# EAGLE design ECU (EAGLE 6.6.0)

## Sheet 1 of 3
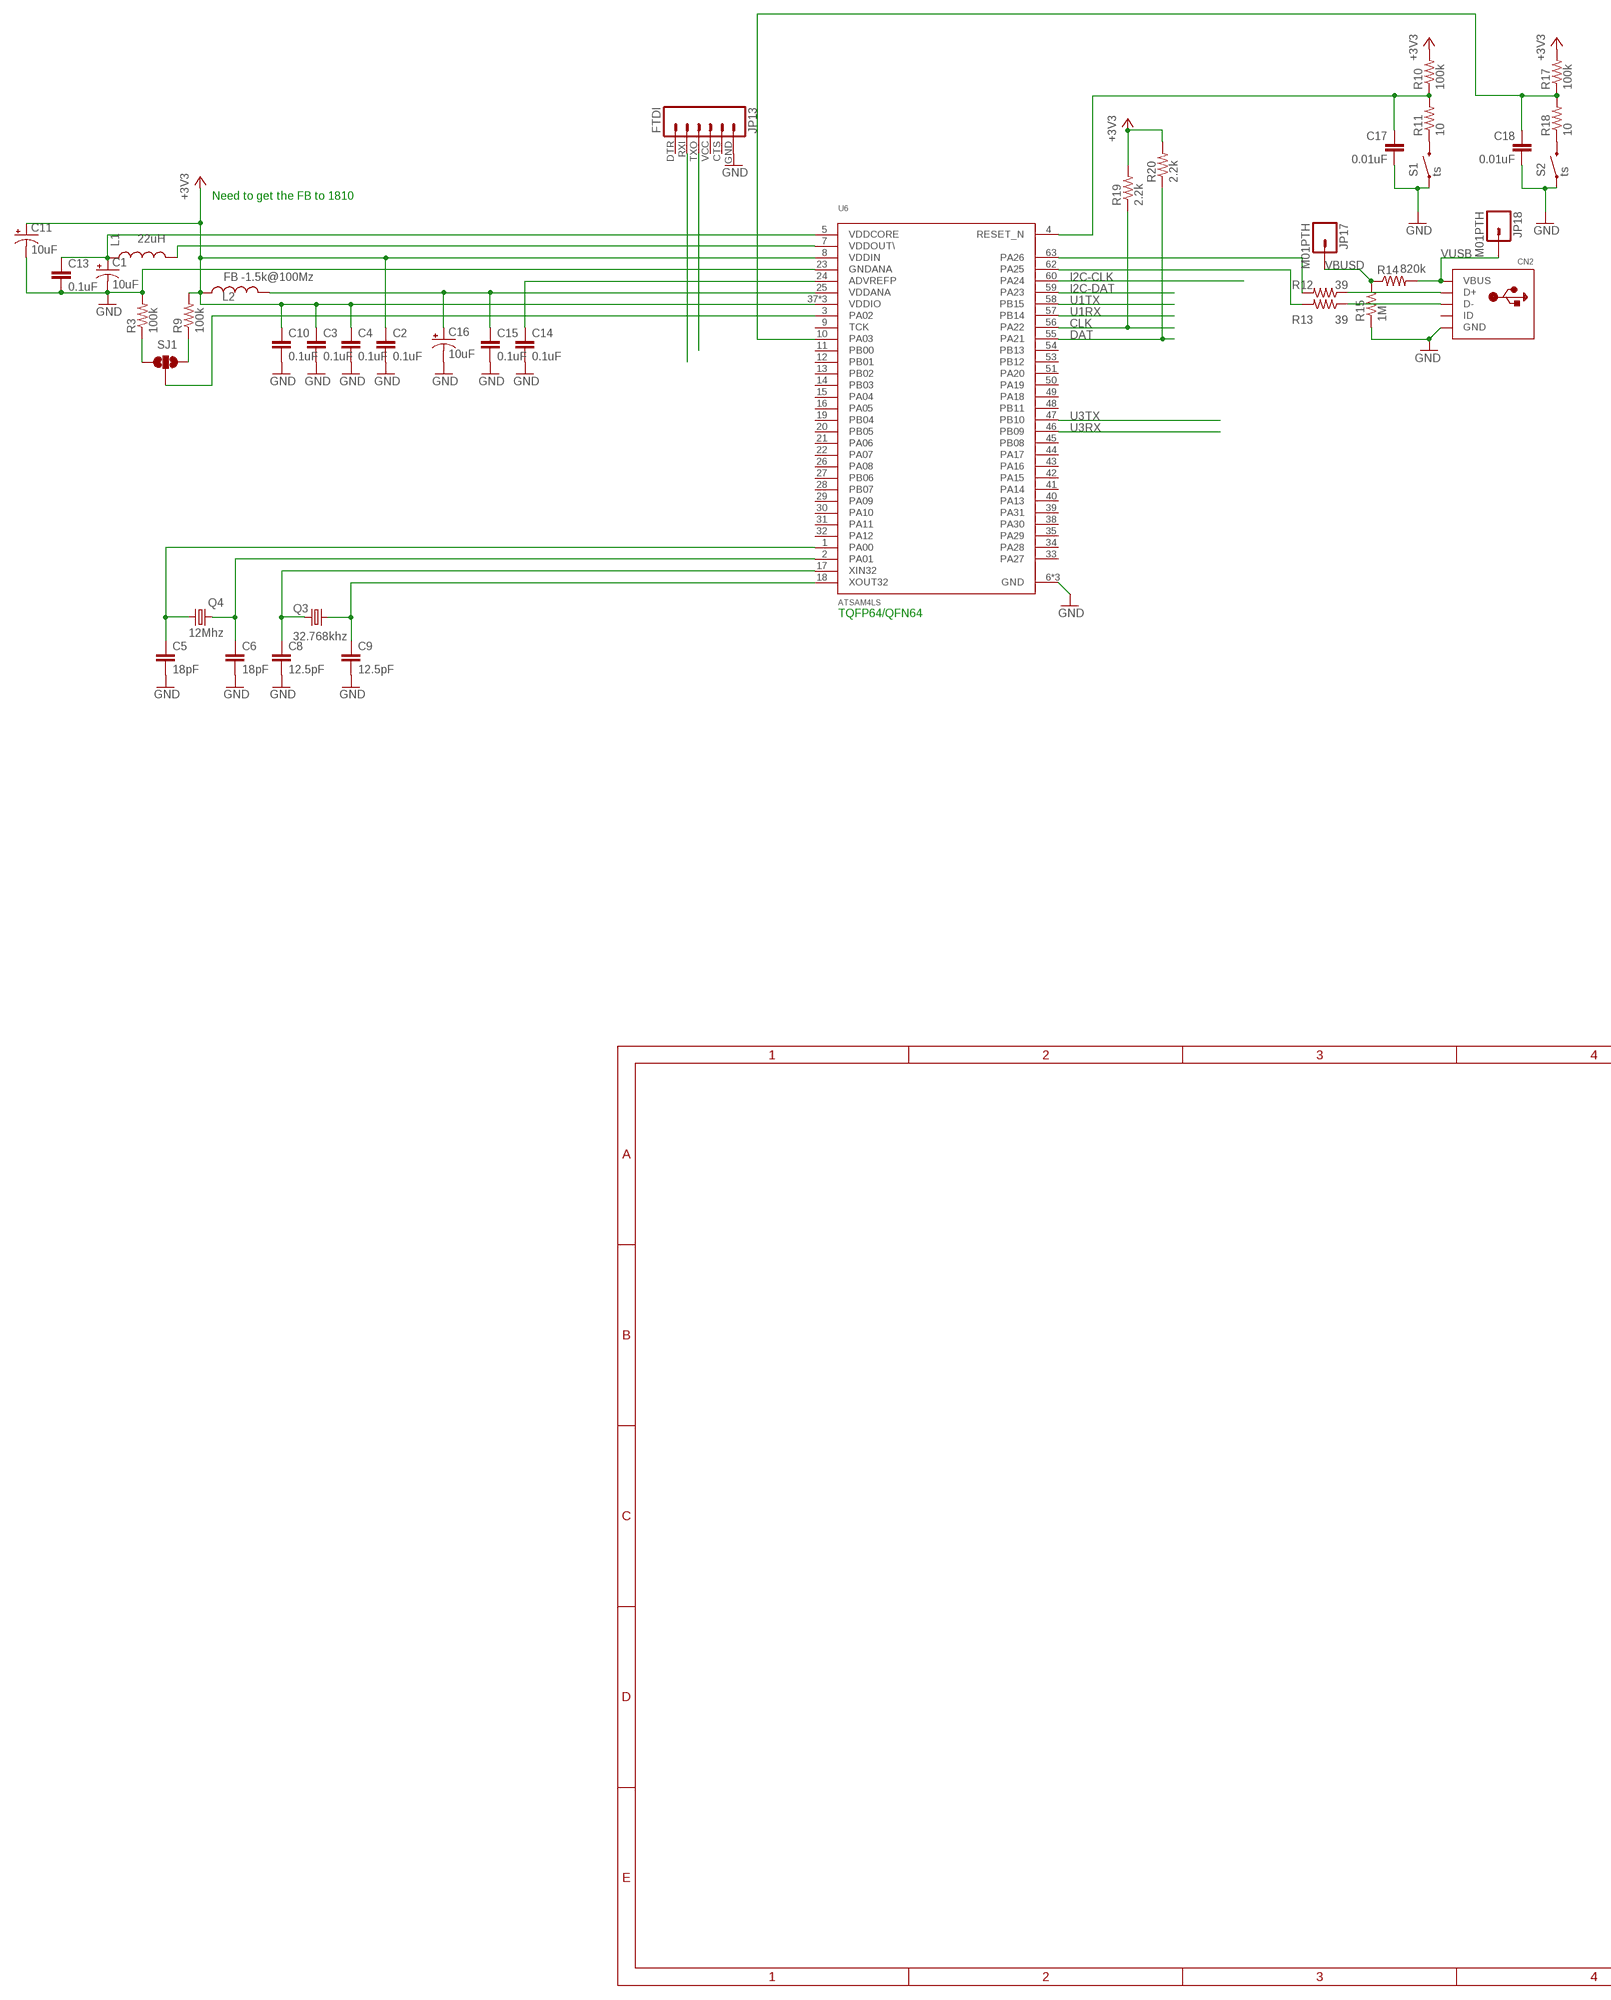
[diagram p0: schematic, sheet 1, part 1 of 2]
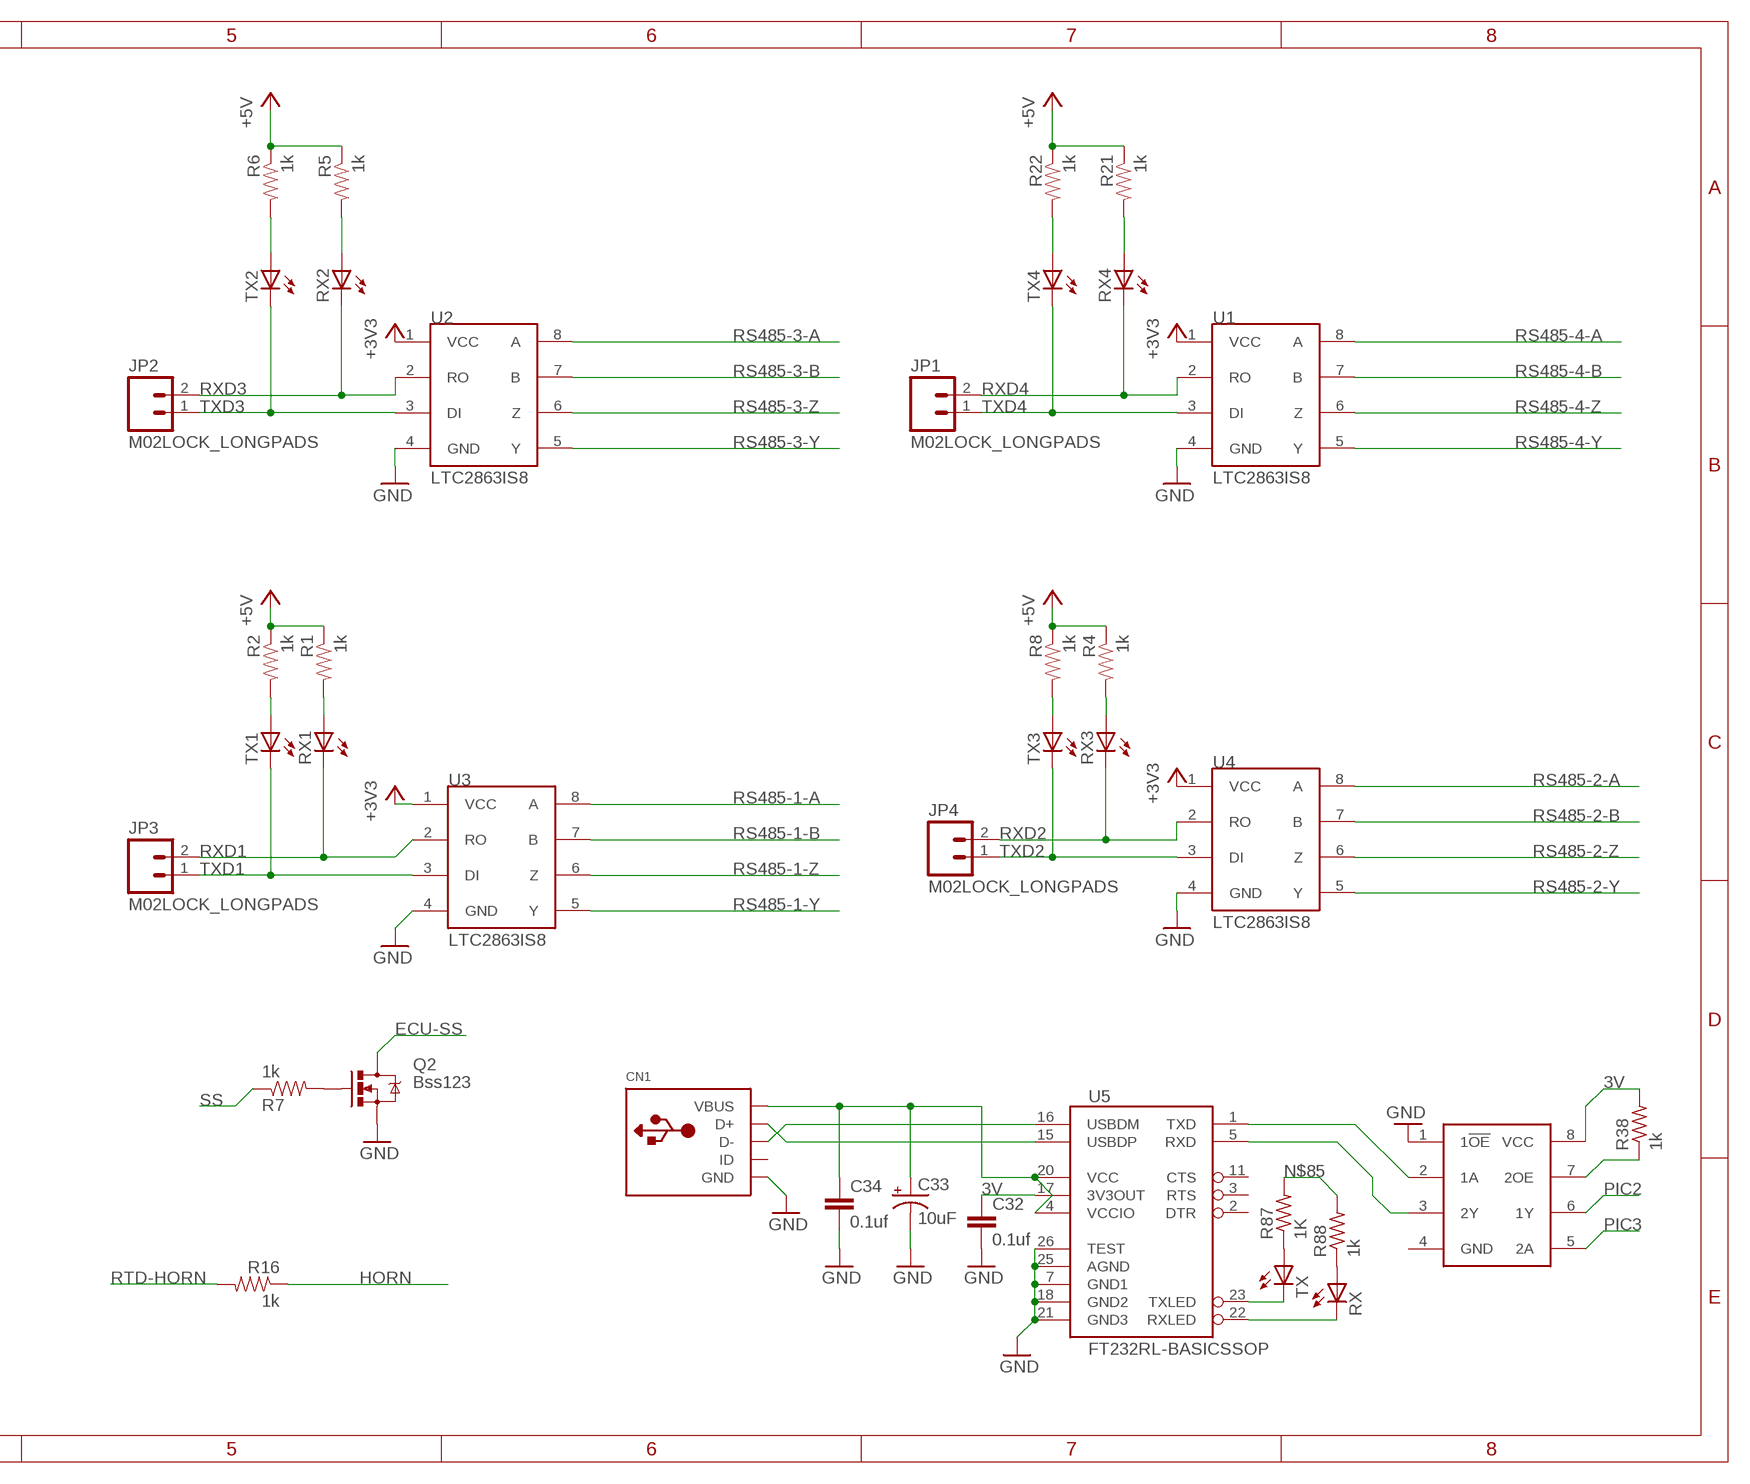
[diagram p1: schematic, sheet 1, part 2 of 2]

### Parts
C1  10uF  CAP_POL1206  [EIA3216]
C2  0.1uF  CAP0805  [0805]
C3  0.1uF  CAP0805  [0805]
C4  0.1uF  CAP0805  [0805]
C5  18pF  CAP0805  [0805]
C6  18pF  CAP0805  [0805]
C8  12.5pF  CAP0805  [0805]
C9  12.5pF  CAP0805  [0805]
C10  0.1uF  CAP0805  [0805]
C11  10uF  10UF-16V-10%(TANT)  [EIA3216]
C13  0.1uF  CAP0805  [0805]
C14  0.1uF  CAP0805  [0805]
C15  0.1uF  CAP0805  [0805]
C16  10uF  CAP_POL1206  [EIA3216]
C17  0.01uF  CAP0805  [0805]
C18  0.01uF  CAP0805  [0805]
C32  0.1uf  CAP0805  [0805]
C33  10uF  CAP_POL1206  [EIA3216]
C34  0.1uf  CAP0805  [0805]
CN1  USBMOLEX  [USB-MINIB-THM-MOLEX]
CN2  USBMOLEX  [USB-MINIB-THM-MOLEX]
JP1  M02LOCK_LONGPADS  [1X02_LOCK_LONGPADS]
JP2  M02LOCK_LONGPADS  [1X02_LOCK_LONGPADS]
JP3  M02LOCK_LONGPADS  [1X02_LOCK_LONGPADS]
JP4  M02LOCK_LONGPADS  [1X02_LOCK_LONGPADS]
JP13  FTDI  FTDI_BASICPTH  [FTDI_BASIC]
JP17  M01PTH  [1X01]
JP18  M01PTH  [1X01]
L1  22uH  INDUCTOR0805  [0805]
L2  FB -1.5k@100Mz  INDUCTOR0805  [0805]
Q2  Bss123  MOSFET-NCHANNELBSS123LT1G  [SOT23]
Q3  32.768khz  CRYSTALMM20SS  [MM20SS]
Q4  12Mhz  CRYSTALCTS406  [CTS406]
R1  1k  RESISTOR0805-RES  [0805]
R2  1k  RESISTOR0805-RES  [0805]
R3  100k  RESISTOR0805-RES  [0805]
R4  1k  RESISTOR0805-RES  [0805]
R5  1k  RESISTOR0805-RES  [0805]
R6  1k  RESISTOR0805-RES  [0805]
R7  1k  RESISTOR0805-RES  [0805]
R8  1k  RESISTOR0805-RES  [0805]
R9  100k  RESISTOR0805-RES  [0805]
R10  100k  RESISTOR0805-RES  [0805]
R11  10  RESISTOR0805-RES  [0805]
R12  39  RESISTOR0805-RES  [0805]
R13  39  RESISTOR0805-RES  [0805]
R14  820k  RESISTOR0805-RES  [0805]
R15  1M  RESISTOR0805-RES  [0805]
R16  1k  RESISTOR0805-RES  [0805]
R17  100k  RESISTOR0805-RES  [0805]
R18  10  RESISTOR0805-RES  [0805]
R19  2.2k  RESISTOR0805-RES  [0805]
R20  2.2k  RESISTOR0805-RES  [0805]
R21  1k  RESISTOR0805-RES  [0805]
R22  1k  RESISTOR0805-RES  [0805]
R38  1k  R-US_R0805  [R0805]
R87  1K  R-US_R0805  [R0805]
R88  1k  R-US_R0805  [R0805]
RX  LEDCHIPLED_0805  [CHIPLED_0805]
RX1  LEDCHIP-LED0805  [CHIP-LED0805]
RX2  LEDCHIP-LED0805  [CHIP-LED0805]
RX3  LEDCHIP-LED0805  [CHIP-LED0805]
RX4  LEDCHIP-LED0805  [CHIP-LED0805]
S1  ts  SWITCH-MOMENTARY-2SIDE_EZ  [TACTILE-PTH-SIDEEZ]
S2  ts  SWITCH-MOMENTARY-2SIDE_EZ  [TACTILE-PTH-SIDEEZ]
SJ1  SOLDERJUMPER_2WAYS  [SJ_3]
TX  LEDCHIPLED_0805  [CHIPLED_0805]
TX1  LEDCHIP-LED0805  [CHIP-LED0805]
TX2  LEDCHIP-LED0805  [CHIP-LED0805]
TX3  LEDCHIP-LED0805  [CHIP-LED0805]
TX4  LEDCHIP-LED0805  [CHIP-LED0805]
U1  LTC2863IS8  ISL83077  [SO08]
U2  LTC2863IS8  ISL83077  [SO08]
U3  LTC2863IS8  ISL83077  [SO08]
U4  LTC2863IS8  ISL83077  [SO08]
U5  FT232RL-BASICSSOP  [SSOP28DB]
U6  ATSAM4LS  SAM4L  [TQFP-64]
U14  SN74LVC2G241DCTR  [VFSOP-8]

### Nets
3V: C32.1 R38.2 U5.17(3V3OUT) U14.8(VCC)
+3V3: C2.1 C3.1 C4.1 C10.1 C11.A(+) L2.1 R9.2 R10.2 R17.2 R19.2 R20.2 U1.1(VCC) U2.1(VCC) U3.1(VCC) U4.1(VCC) U6.8(VDDIN) U6.37(VDDIO) U6.52(VDDIO) U6.61(VDDIO) ; also sheet 2
+5V: R1.1 R2.1 R4.1 R5.1 R6.1 R8.1 R21.1 R22.1
CLK: R19.1 U6.56(PA22)
DAT: R20.1 U6.55(PA21)
ECU-SS: Q2.3(D)
GND: C1.C(-) C2.2 C3.2 C4.2 C5.2 C6.2 C8.2 C9.2 C10.2 C11.C(-) C13.2 C14.2 C15.2 C16.C(-) C17.2 C18.2 C32.2 C33.C(-) C34.2 CN1.GND CN2.GND JP13.GND Q2.2(S) R3.2 R15.1 S1.1 S2.1 U1.4(GND) U2.4(GND) U3.4(GND) U4.4(GND) U5.7(GND1) U5.18(GND2) U5.21(GND3) U5.25(AGND) U5.26(TEST) U6.6(GND) U6.23(GNDANA) U6.36(GND) U6.64(GND) U14.1(1!OE) ; also sheet 2,3
HORN: R16.1
I2C-CLK: U6.60(PA24)
I2C-DAT: U6.59(PA23)
N$2: R11.1 S1.2
N$3: L1.2 U6.7(VDDOUT\)
N$4: R38.1 U14.7(2OE)
N$5: C1.A(+) C13.1 L1.1 U6.5(VDDCORE)
N$6: C8.1 Q3.1 U6.17(XIN32)
N$7: R1.2 RX1.A
N$8: R2.2 TX1.A
N$9: C9.1 Q3.4 U6.18(XOUT32)
N$10: C6.1 Q4.1 U6.2(PA01)
N$11: C5.1 Q4.3 U6.1(PA00)
N$12: R4.2 RX3.A
N$13: R8.2 TX3.A
N$14: R3.1 SJ1.3
N$15: R9.1 SJ1.1
N$16: C15.1 C16.A(+) L2.2 U6.25(VDDANA)
N$17: R5.2 RX2.A
N$18: R6.2 TX2.A
N$19: SJ1.2 U6.3(PA02)
N$20: C14.1 U6.24(ADVREFP)
N$21: C17.1 R10.1 R11.2 U6.4(RESET_N)
N$22: CN2.D+ R12.1
N$24: R21.2 RX4.A
N$25: CN2.D- R13.1
N$26: R18.1 S2.2
N$27: C18.1 R17.1 R18.2 U6.10(PA03)
N$28: Q2.1(G) R7.2
N$29: R12.2 U6.63(PA26)
N$30: R13.2 U6.62(PA25)
N$44: R22.2 TX4.A
N$78: CN1.D- U5.16(USBDM)
N$79: CN1.D+ U5.15(USBDP)
N$81: R87.1 TX.A
N$82: R88.1 RX.A
N$83: TX.C U5.23(TXLED)
N$84: RX.C U5.22(RXLED)
N$85: C33.A(+) C34.1 CN1.VBUS R87.2 R88.2 U5.4(VCCIO) U5.20(VCC)
N$93: U5.1(TXD) U14.2(1A)
N$94: U5.5(RXD) U14.3(2Y)
PIC2: U14.6(1Y)
PIC3: U14.5(2A)
RS485-1-A: U3.8(A) ; also sheet 3
RS485-1-B: U3.7(B) ; also sheet 3
RS485-1-Y: U3.5(Y) ; also sheet 3
RS485-1-Z: U3.6(Z) ; also sheet 3
RS485-2-A: U4.8(A) ; also sheet 3
RS485-2-B: U4.7(B) ; also sheet 3
RS485-2-Y: U4.5(Y) ; also sheet 3
RS485-2-Z: U4.6(Z) ; also sheet 3
RS485-3-A: U2.8(A) ; also sheet 3
RS485-3-B: U2.7(B) ; also sheet 3
RS485-3-Y: U2.5(Y) ; also sheet 3
RS485-3-Z: U2.6(Z) ; also sheet 3
RS485-4-A: U1.8(A) ; also sheet 3
RS485-4-B: U1.7(B) ; also sheet 3
RS485-4-Y: U1.5(Y) ; also sheet 3
RS485-4-Z: U1.6(Z) ; also sheet 3
RTD-HORN: R16.2
RXD1: JP3.2 RX1.C U3.2(RO)
RXD2: JP4.2 RX3.C U4.2(RO)
RXD3: JP2.2 RX2.C U2.2(RO)
RXD4: JP1.2 RX4.C U1.2(RO)
SS: R7.1
TXD1: JP3.1 TX1.C U3.3(DI)
TXD2: JP4.1 TX3.C U4.3(DI)
TXD3: JP2.1 TX2.C U2.3(DI)
TXD4: JP1.1 TX4.C U1.3(DI)
U0RX: JP13.TXO
U0TX: JP13.RXI
U1RX: U6.57(PB14)
U1TX: U6.58(PB15)
U3RX: U6.46(PB09)
U3TX: U6.47(PB10)
VBUSD: JP17.1 R14.1 R15.2
VUSB: CN2.VBUS JP18.1 R14.2
Unconnected: CN1.ID CN2.ID JP13.CTS JP13.DTR JP13.VCC U5.2(DTR) U5.3(RTS) U5.11(CTS) U6.9(TCK) U6.11(PB00) U6.12(PB01) U6.13(PB02) U6.14(PB03) U6.15(PA04) U6.16(PA05) U6.19(PB04) U6.20(PB05) U6.21(PA06) U6.22(PA07) U6.26(PA08) U6.27(PB06) U6.28(PB07) U6.29(PA09) U6.30(PA10) U6.31(PA11) U6.32(PA12) U6.33(PA27) U6.34(PA28) U6.35(PA29) U6.38(PA30) U6.39(PA31) U6.40(PA13) U6.41(PA14) U6.42(PA15) U6.43(PA16) U6.44(PA17) U6.45(PB08) U6.48(PB11) U6.49(PA18) U6.50(PA19) U6.51(PA20) U6.53(PB12) U6.54(PB13) U14.4(GND)

### Notes on the sheet
- Need to get the FB to 1810
- TQFP64/QFN64

## Sheet 2 of 3
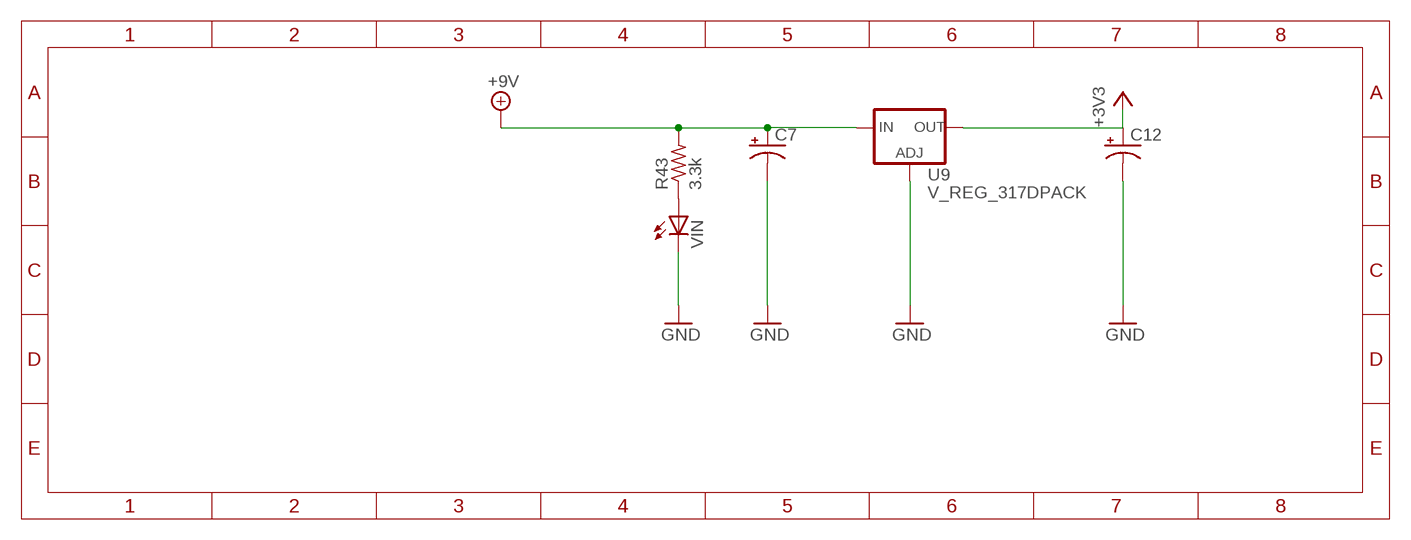
[diagram p2: schematic, sheet 2]

### Parts
C7  CAP_POL7343  [EIA7343]
C12  CAP_POL3528  [EIA3528]
R43  3.3k  R-US_R0805  [R0805]
U9  V_REG_317DPACK  [V-REG_DPACK]
VIN  LEDCHIP-LED0805  [CHIP-LED0805]

### Nets
+3V3: C12.A(+) U9.4(OUT) ; also sheet 1
+9V: C7.A(+) R43.2 U9.3(IN) ; also sheet 3
GND: C7.C(-) C12.C(-) U9.1(ADJ) VIN.C ; also sheet 1,3
N$33: R43.1 VIN.A

## Sheet 3 of 3
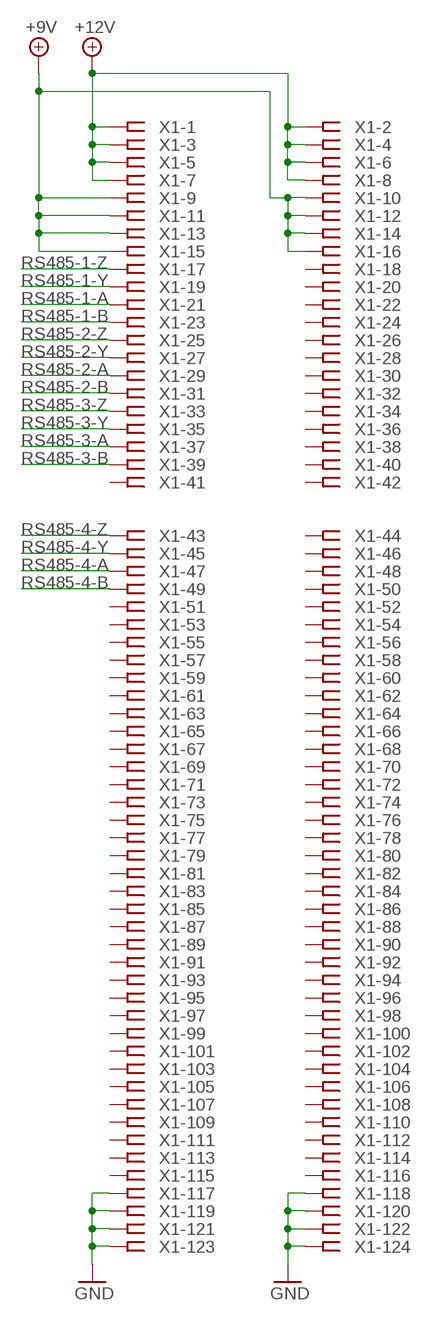
[diagram p3: schematic, sheet 3]

### Parts
X1  AGP-3X3  [AGP-3X3]

### Nets
+9V: X1.9 X1.10 X1.11 X1.12 X1.13 X1.14 X1.15 X1.16 ; also sheet 2
+12V: X1.1 X1.2 X1.3 X1.4 X1.5 X1.6 X1.7 X1.8
GND: X1.117 X1.118 X1.119 X1.120 X1.121 X1.122 X1.123 X1.124 ; also sheet 1,2
RS485-1-A: X1.21 ; also sheet 1
RS485-1-B: X1.23 ; also sheet 1
RS485-1-Y: X1.19 ; also sheet 1
RS485-1-Z: X1.17 ; also sheet 1
RS485-2-A: X1.29 ; also sheet 1
RS485-2-B: X1.31 ; also sheet 1
RS485-2-Y: X1.27 ; also sheet 1
RS485-2-Z: X1.25 ; also sheet 1
RS485-3-A: X1.37 ; also sheet 1
RS485-3-B: X1.39 ; also sheet 1
RS485-3-Y: X1.35 ; also sheet 1
RS485-3-Z: X1.33 ; also sheet 1
RS485-4-A: X1.47 ; also sheet 1
RS485-4-B: X1.49 ; also sheet 1
RS485-4-Y: X1.45 ; also sheet 1
RS485-4-Z: X1.43 ; also sheet 1
Unconnected: X1.18 X1.20 X1.22 X1.24 X1.26 X1.28 X1.30 X1.32 X1.34 X1.36 X1.38 X1.40 X1.41 X1.42 X1.44 X1.46 X1.48 X1.50 X1.51 X1.52 X1.53 X1.54 X1.55 X1.56 X1.57 X1.58 X1.59 X1.60 X1.61 X1.62 X1.63 X1.64 X1.65 X1.66 X1.67 X1.68 X1.69 X1.70 X1.71 X1.72 X1.73 X1.74 X1.75 X1.76 X1.77 X1.78 X1.79 X1.80 X1.81 X1.82 X1.83 X1.84 X1.85 X1.86 X1.87 X1.88 X1.89 X1.90 X1.91 X1.92 X1.93 X1.94 X1.95 X1.96 X1.97 X1.98 X1.99 X1.100 X1.101 X1.102 X1.103 X1.104 X1.105 X1.106 X1.107 X1.108 X1.109 X1.110 X1.111 X1.112 X1.113 X1.114 X1.115 X1.116

## Library data of the parts
C1 C16 = SparkFun-Passives:CAP_POL: Capacitor Polarized These are standard SMD and PTH capacitors. Normally 10uF, 47uF, and 100uF in electrolytic and tantalum varieties. Always verify the external diameter of the through hole cap, it varies with capacity, voltage, and manufacturer. The EIA devices should be standard.
C2-C6 C8-C10 C13-C15 C17 C18 = SparkFun-Passives:CAP: Capacitor Standard 0603 ceramic capacitor, and 0.1" leaded capacitor.
C7 C12 = SparkFun-Capacitors:CAP_POL: Capacitor Polarized These are standard SMD and PTH capacitors. Normally 10uF, 47uF, and 100uF in electrolytic and tantalum varieties. Always verify the external diameter of the through hole cap, it varies with capacity, voltage, and manufacturer. The EIA devices should be standard.
C11 = SparkFun-Capacitors:10UF-16V-10%(TANT): CAP-00811 1206/EIA-3216 Tantalum capacitor; PROD_ID: CAP-00811
C32 C34 = SparkFun:CAP: Capacitor Standard 0603 ceramic capacitor, and 0.1" leaded capacitor.
C33 = SparkFun:CAP_POL: Capacitor Polarized These are standard SMD and PTH capacitors. Normally 10uF, 47uF, and 100uF in electrolytic and tantalum varieties. Always verify the external diameter of the through hole cap, it varies with capacity, voltage, and manufacturer. The EIA devices should be standard.
CN1 CN2 = adafruit:USB: USB Connectors USBMINIB - Surface Mount Female Mini-B USB Connector 4UConnector: 06564 By microbuilder.eu Thru-hole RA Female Mini-B USB Connector 4UConnector: 18732 By ladyada.net
JP1-JP4 = SparkFun-Connectors:M02: Standard 2-pin 0.1" header. Use with - straight break away headers ( PRT-00116) - right angle break away headers (PRT-00553) - swiss pins (PRT-00743) - machine pins (PRT-00117) - female headers (PRT-00115) Molex polarized connector foot print use with: PRT-08233 with associated crimp pins and housings. 2.54_SCREWTERM for use with PRT-10571. 3.5mm Screw Terminal footprints for PRT-08084 5mm Screw Terminal footprints for use with PRT-08433
JP13 = SparkFun-Connectors:FTDI_BASIC: FTDI Basic header with labels
JP17 JP18 = SparkFun-Connectors:M01: Header 1 Standard 1-pin 0.1" header. Use with straight break away headers (SKU : PRT-00116), right angle break away headers (PRT-00553), swiss pins (PRT-00743), machine pins (PRT-00117), and female headers (PRT-00115).
L1 L2 = SparkFun-Passives:INDUCTOR: Inductors Basic Inductor/Choke - 0603 and 1206. Footprints are not proven and vary greatly between part numbers. SRN6045- 33uH, 20% 1.4A
Q2 = SparkFun-DiscreteSemi:MOSFET-NCHANNEL: Common NMOSFET Parts MFG P/N Store ID Prod ID FDD8780 TRANS-09984 SI7820DN TRANS-11055 FDS6630A IC-08089 2N7002PW TRANS-11151 FQP30N06L COM-10213 TRANS-10060 BSS123LT1G TRANS-08345 BSS138 TRANS-00830 BS170 2N7000; PROD_ID: TRANS-08345
Q3 Q4 = adafruit:CRYSTAL: CRYSTAL; OC_FARNELL: unknown; OC_NEWARK: unknown
R1-R22 = SparkFun-Passives:RESISTOR: Resistor Basic schematic elements and footprints for 0603, 1206, and PTH resistors.
R38 R43 R87 R88 = adafruit:R-US_: RESISTOR, American symbol
RX RX1-RX4 TX TX1-TX4 VIN = adafruit:LED: LED OSRAM: - CHIPLED LG R971, LG N971, LY N971, LG Q971, LY Q971, LO R971, LY R971 LH N974, LH R974 LS Q976, LO Q976, LY Q976 LO Q996 - Hyper CHIPLED LW Q18S LB Q993, LB Q99A, LB R99A - SideLED LS A670, LO A670, LY A670, LG A670, LP A670 LB A673, LV A673, LT A673, LW A673 LH A674 LY A675 LS A676, LA A676, LO A676, LY A676, LW A676 LS A679, LY A679, LG A679 - Hyper Micro SIDELED® LS Y876, LA Y876, LO Y876, LY Y876 LT Y87S - SmartLED LW L88C, LW L88S LB L89C, LB L89S, LG L890 LS L89K, LO L89K, LY L89K LS L896, LA L896, LO L896, LY L896 - TOPLED LS T670, LO T670, LY T670, LG T670, LP T670 LSG T670, LSP T670, LSY T670, LOP T670, LYG T670 LG T671, LOG T671, LSG T671 LB T673, LV T673, LT T673, LW T673 LH T674 LS T676, LA T676, LO T676, LY T676, LB T676, LH T676, LSB T676, LW T676 LB T67C, LV T67C, LT T67C, LS T67K, LO T67K, LY T67K, LW E67C LS E67B, LA E67B, LO E67B, LY E67B, LB E67C, LV E67C, LT E67C LW T67C LS T679, LY T679, LG T679 LS T770, LO T770, LY T770, LG T770, LP T770 LB T773, LV T773, LT T773, LW T773 LH T774 LS E675, LA E675, LY E675, LS T675 LS T776, LA T776, LO T776, LY T776, LB T776 LHGB T686 LT T68C, LB T68C - Hyper Mini TOPLED® LB M676 - Mini TOPLED Santana® LG M470 LS M47K, LO M47K, LY M47K Source: http://www.osram.convergy.de/
S1 S2 = SparkFun-Electromechanical:SWITCH-MOMENTARY-2: Various NO switches- pushbuttons, reed, etc
SJ1 = SparkFun-Passives:SOLDERJUMPER_2WAY: Solder Jumper 2 way solder jumper
U1-U4 = NASA_LIB:ISL83077
U5 = SparkFun:FT232RL-BASIC: USB UART This is the simplified version of the FT232RL unit. Only what you need, nothing you don't. Spark Fun Electronics SKU : COM-00650
U6 = DFT2:SAM4L
U9 = SparkFun-PowerIC:V_REG_317: Voltage Regulator Standard LM317 adjustable voltage regulator. AOI (Adjust Output Input). Google 'LM317 Calculator' for easy to use app to get the two resistor values needed. 240/720 for 5V output. 240/390 for 3.3V output. Spark Fun Electronics SKU : COM-00527
U14 = Cleaverbrooks:SN74LVC2G241DCTR
X1 = con-pc:AGP-3X3

## Board
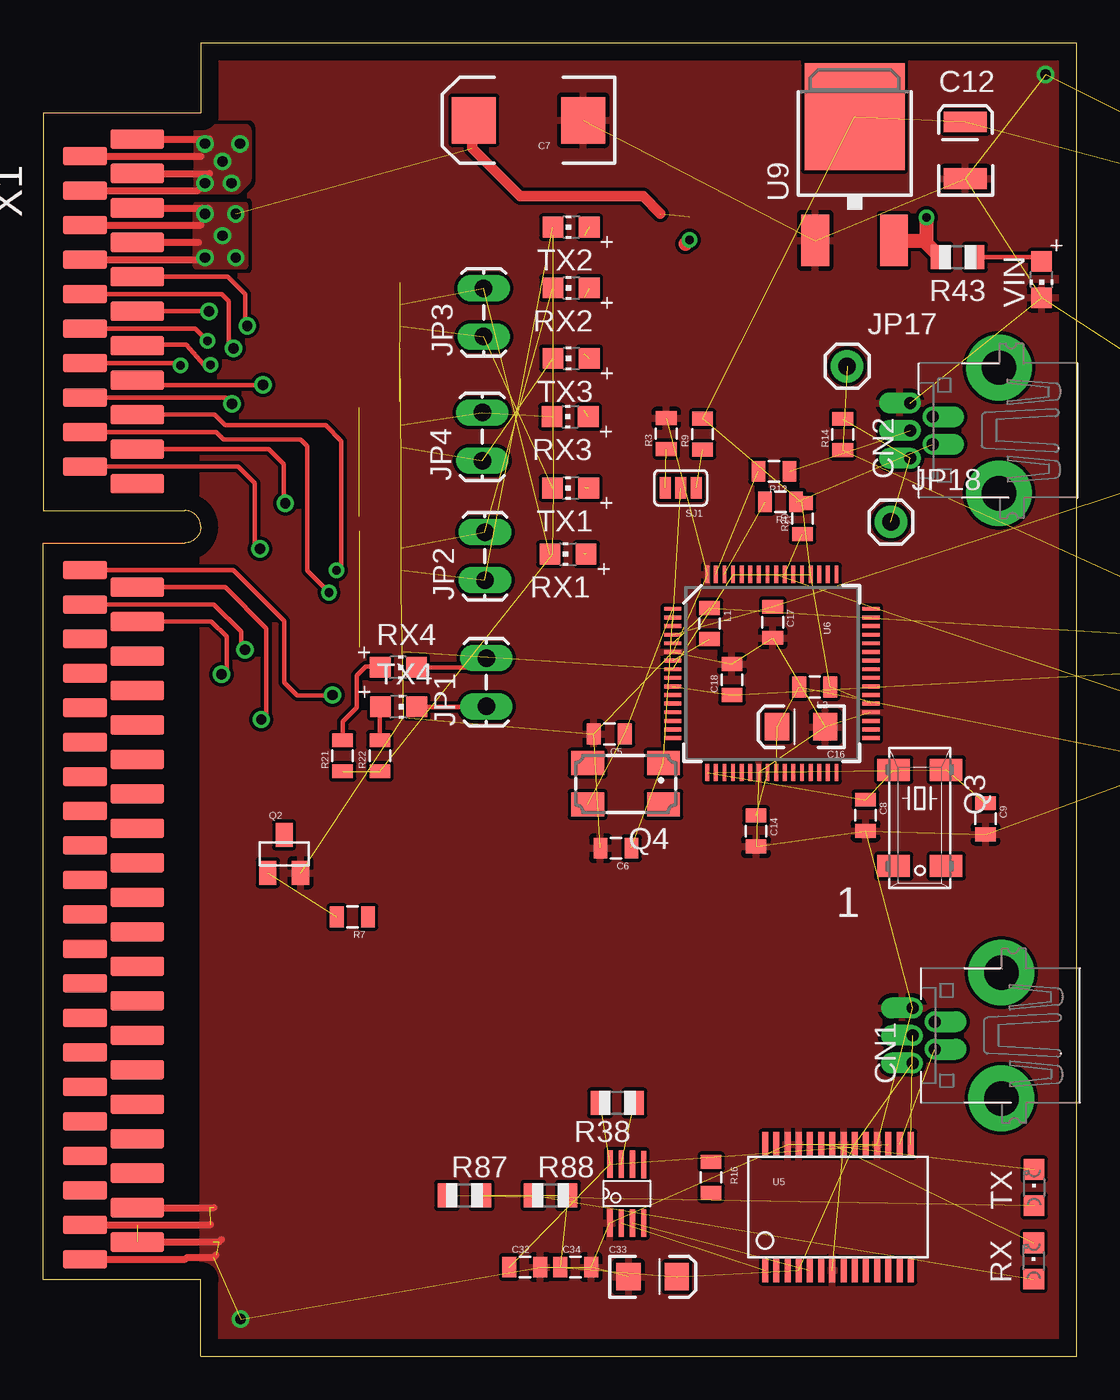
[diagram p4: board, top side]
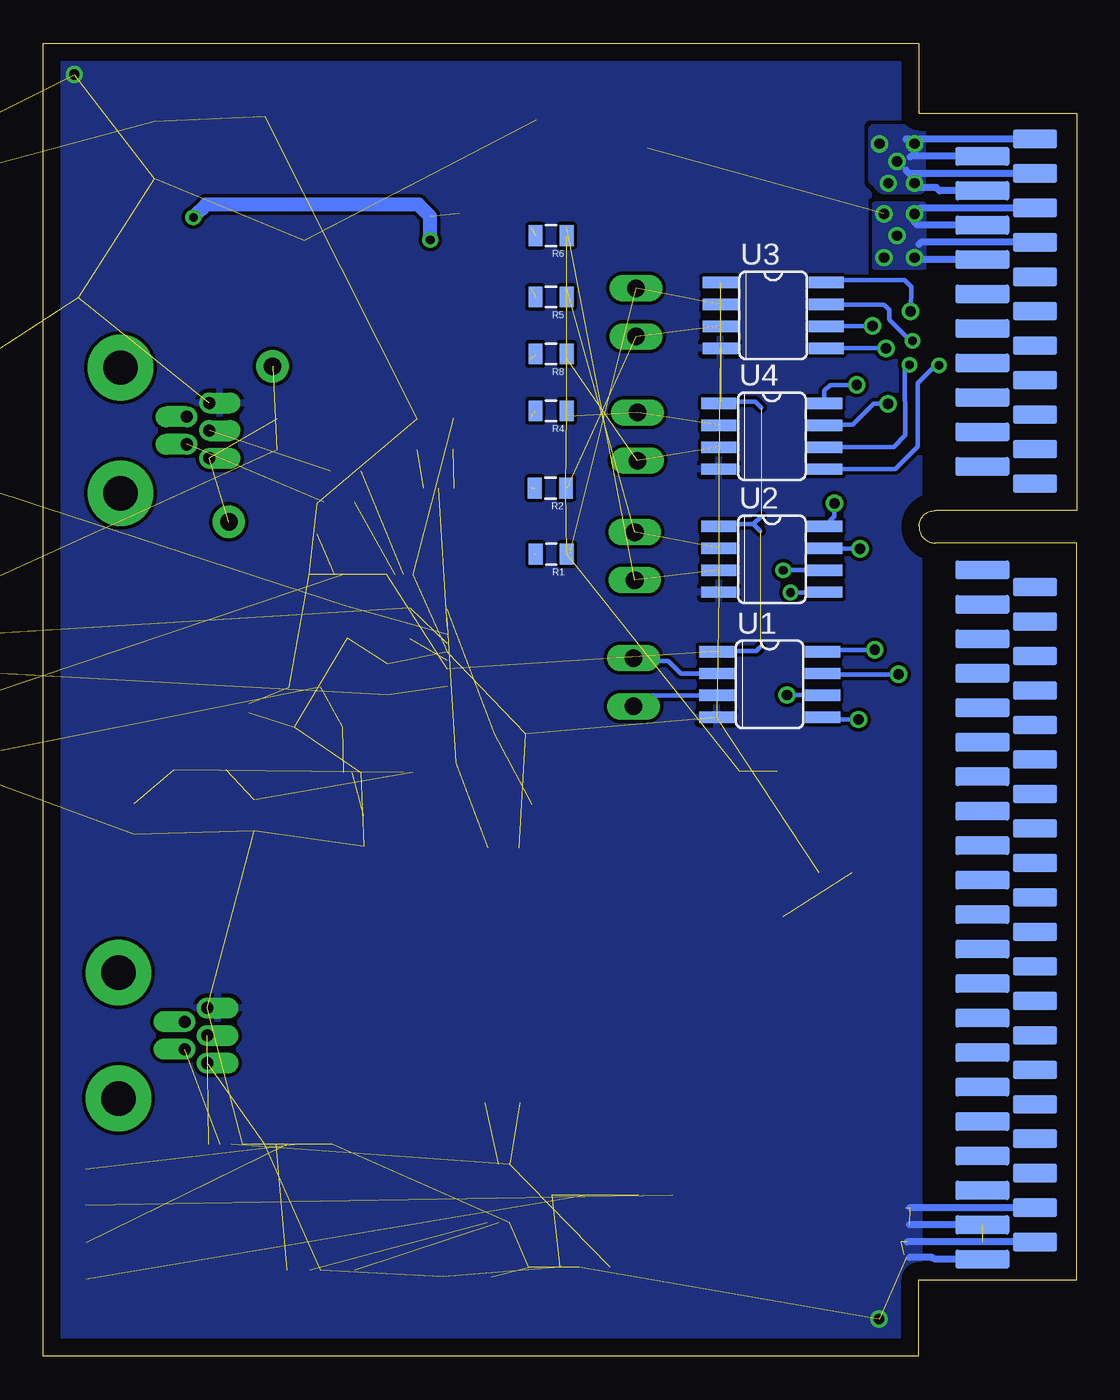
[diagram p5: board, bottom side, seen from below]

Size 59.94 x 76.2 mm. Coordinates in mm from the lower left corner, seen from the top.
Copper layers (1*16): Top 0.035mm / dielectric 1.5mm / Bottom 0.035mm
Design rules "default": minimum track width 10mil, minimum drill 24mil, track to track 8mil, track to pad 8mil, pad to pad 8mil, via to via 8mil, smd to smd 8mil, copper to edge 40mil, drill to drill 8mil, minimum pad ring 10mil, minimum via ring 8mil, stop-mask expansion 4mil, vias tented up to drill 0mil, thermal gap 10mil

### Footprints (pad centres in the part's own frame; a part is rotated, then mirrored left to right if it is on the bottom)
EIA3216 = smd 1.4 x 1.6: A 1.4,0; C -1.4,0
0805 = smd 0.8 x 1.2: 1 -0.9,0; 2 0.9,0
EIA7343 = smd 2.55 x 2.7: A 3.17,0; C -3.17,0
EIA3528 = smd 1.2 x 2.5: A 1.65,0; C -1.65,0
USB-MINIB-THM-MOLEX = drill 0.7 offset: D+ 0,9.72; D- -0.8,8.42; GND 1.6,9.72; ID 0.8,8.42; VBUS -1.6,9.72 | drill 2 pad 3.81: GND1 -3.65,4.57; GND4 3.65,4.57
1X02_LOCK_LONGPADS = drill 1.016 long: 1 -0.127,0; 2 2.667,0
FTDI_BASIC = drill 1.016 pad 1.88: CTS 10.16,0; DTR 0,0; GND 12.7,0; RXI 2.54,0; TXO 5.08,0; VCC 7.62,0
1X01 = drill 1.016 pad 1.88: 1 0,0
SOT23 = smd 1 x 1.4: 1 -0.95,-1.1; 2 0.95,-1.1; 3 0,1.1
MM20SS = smd 1.27 x 1.88: 1 -2.794,-1.524; 2 2.794,-1.524; 3 2.794,1.524; 4 -2.794,1.524
CTS406 = smd 1.9 x 1.4: 1 -2.2,-1.2; 2 2.2,-1.2; 3 2.2,1.2; 4 -2.2,1.2
R0805 = smd 1.1 x 1.4: 1 -1,0; 2 1,0
CHIPLED_0805 = smd 1.2 x 1.2: A 0,-1.05; C 0,1.05
CHIP-LED0805 = smd 1.2 x 1.2: A 0,-1.05; C 0,1.05
TACTILE-PTH-SIDEEZ = drill 0.8 pad 1.7: 1 -2.5,0; 2 2.5,0 | drill 1.2 pad 2.2: ANCHOR1 -3.5,2.5; ANCHOR2 3.5,2.5
SJ_3 = smd 0.635 x 1.27: 1 -0.889,0; 2 0,0; 3 0.889,0
SO08 = smd 0.66 x 2.032: 1 -1.905,-3.073; 2 -0.635,-3.073; 3 0.635,-3.073; 4 1.905,-3.073; 5 1.905,3.073; 6 0.635,3.073; 7 -0.635,3.073; 8 -1.905,3.073
SSOP28DB = smd 0.348 x 1.397: 1 -4.225,-3.656; 2 -3.575,-3.656; 3 -2.925,-3.656; 4 -2.275,-3.656; 5 -1.625,-3.656; 6 -0.975,-3.656; 7 -0.325,-3.656; 8 0.325,-3.656; 9 0.975,-3.656; 10 1.625,-3.656; 11 2.275,-3.656; 12 2.925,-3.656; 13 3.575,-3.656; 14 4.225,-3.656; 15 4.225,3.656; 16 3.575,3.656; 17 2.925,3.656; 18 2.275,3.656; 19 1.625,3.656; 20 0.975,3.656; 21 0.325,3.656; 22 -0.325,3.656; 23 -0.975,3.656; 24 -1.625,3.656; 25 -2.275,3.656; 26 -2.925,3.656; 27 -3.575,3.656; 28 -4.225,3.656
TQFP-64 = smd 0.22 x 1: 1 -3.75,-5.75; 2 -3.25,-5.75; 3 -2.75,-5.75; 4 -2.25,-5.75; 5 -1.75,-5.75; 6 -1.25,-5.75; 7 -0.75,-5.75; 8 -0.25,-5.75; 9 0.25,-5.75; 10 0.75,-5.75; 11 1.25,-5.75; 12 1.75,-5.75; 13 2.25,-5.75; 14 2.75,-5.75; 15 3.25,-5.75; 16 3.75,-5.75; 33 3.75,5.75; 34 3.25,5.75; 35 2.75,5.75; 36 2.25,5.75; 37 1.75,5.75; 38 1.25,5.75; 39 0.75,5.75; 40 0.25,5.75; 41 -0.25,5.75; 42 -0.75,5.75; 43 -1.25,5.75; 44 -1.75,5.75; 45 -2.25,5.75; 46 -2.75,5.75; 47 -3.25,5.75; 48 -3.75,5.75 | smd 1 x 0.22: 17 5.75,-3.75; 18 5.75,-3.25; 19 5.75,-2.75; 20 5.75,-2.25; 21 5.75,-1.75; 22 5.75,-1.25; 23 5.75,-0.75; 24 5.75,-0.25; 25 5.75,0.25; 26 5.75,0.75; 27 5.75,1.25; 28 5.75,1.75; 29 5.75,2.25; 30 5.75,2.75; 31 5.75,3.25; 32 5.75,3.75; 49 -5.75,3.75; 50 -5.75,3.25; 51 -5.75,2.75; 52 -5.75,2.25; 53 -5.75,1.75; 54 -5.75,1.25; 55 -5.75,0.75; 56 -5.75,0.25; 57 -5.75,-0.25; 58 -5.75,-0.75; 59 -5.75,-1.25; 60 -5.75,-1.75; 61 -5.75,-2.25; 62 -5.75,-2.75; 63 -5.75,-3.25; 64 -5.75,-3.75
V-REG_DPACK = smd 1.6 x 3: 1 -2.28,-4.8; 3 2.28,-4.8 | smd 5.8 x 6.2: 4 0,2.38
VFSOP-8 = smd 0.3 x 1.6: 1 -0.98,-1.7; 2 -0.33,-1.7; 3 0.33,-1.7; 4 0.98,-1.7; 5 0.97,1.69; 6 0.325,1.7; 7 -0.33,1.7; 8 -0.98,1.71
AGP-3X3 = smd 3.09 x 1.09: 1 -3.684,70.636; 5 -3.684,68.636; 9 -3.684,66.636; 13 -3.684,64.636; 17 -3.684,62.636; 21 -3.684,60.636; 25 -3.684,58.636; 29 -3.684,56.636; 33 -3.684,54.636; 37 -3.684,52.636; 41 -3.684,50.636; 45 -3.684,44.636; 49 -3.684,42.636; 53 -3.684,40.636; 57 -3.684,38.636; 61 -3.684,36.636; 65 -3.684,34.636; 69 -3.684,32.636; 73 -3.684,30.636; 77 -3.684,28.636; 81 -3.684,26.636; 85 -3.684,24.636; 89 -3.684,22.636; 93 -3.684,20.636; 97 -3.684,18.636; 101 -3.684,16.636; 105 -3.684,14.636; 109 -3.684,12.636; 113 -3.684,10.636; 117 -3.684,8.636; 121 -3.684,6.636 | smd 2.56 x 1.09 bottom: 2 -6.724,70.636; 6 -6.724,68.636; 10 -6.724,66.636; 14 -6.724,64.636; 18 -6.724,62.636; 22 -6.724,60.636; 26 -6.724,58.636; 30 -6.724,56.636; 34 -6.724,54.636; 38 -6.724,52.636; 42 -6.724,50.636; 46 -6.724,44.636; 50 -6.724,42.636; 54 -6.724,40.636; 58 -6.724,38.636; 62 -6.724,36.636; 66 -6.724,34.636; 70 -6.724,32.636; 74 -6.724,30.636; 78 -6.724,28.636; 82 -6.724,26.636; 86 -6.724,24.636; 90 -6.724,22.636; 94 -6.724,20.636; 98 -6.724,18.636; 102 -6.724,16.636; 106 -6.724,14.636; 110 -6.724,12.636; 114 -6.724,10.636; 118 -6.724,8.636; 122 -6.724,6.636 | smd 2.56 x 1.09: 3 -6.724,69.636; 7 -6.724,67.636; 11 -6.724,65.636; 15 -6.724,63.636; 19 -6.724,61.636; 23 -6.724,59.636; 27 -6.724,57.636; 31 -6.724,55.636; 35 -6.724,53.636; 39 -6.724,51.636; 43 -6.724,45.636; 47 -6.724,43.636; 51 -6.724,41.636; 55 -6.724,39.636; 59 -6.724,37.636; 63 -6.724,35.636; 67 -6.724,33.636; 71 -6.724,31.636; 75 -6.724,29.636; 79 -6.724,27.636; 83 -6.724,25.636; 87 -6.724,23.636; 91 -6.724,21.636; 95 -6.724,19.636; 99 -6.724,17.636; 103 -6.724,15.636; 107 -6.724,13.636; 111 -6.724,11.636; 115 -6.724,9.636; 119 -6.724,7.636; 123 -6.724,5.636 | smd 3.09 x 1.09 bottom: 4 -3.684,69.636; 8 -3.684,67.636; 12 -3.684,65.636; 16 -3.684,63.636; 20 -3.684,61.636; 24 -3.684,59.636; 28 -3.684,57.636; 32 -3.684,55.636; 36 -3.684,53.636; 40 -3.684,51.636; 44 -3.684,45.636; 48 -3.684,43.636; 52 -3.684,41.636; 56 -3.684,39.636; 60 -3.684,37.636; 64 -3.684,35.636; 68 -3.684,33.636; 72 -3.684,31.636; 76 -3.684,29.636; 80 -3.684,27.636; 84 -3.684,25.636; 88 -3.684,23.636; 92 -3.684,21.636; 96 -3.684,19.636; 100 -3.684,17.636; 104 -3.684,15.636; 108 -3.684,13.636; 112 -3.684,11.636; 116 -3.684,9.636; 120 -3.684,7.636; 124 -3.684,5.636

### Placement (x,y rotation side)
C1  71.68,42.82 180 top  (outside the outline)
C2  67.46,48.18 90 top  (outside the outline)
C3  67.46,51.13 90 top  (outside the outline)
C4  64.97,55.96 90 top  (outside the outline)
C5  32.84,36.12 180 top
C6  33.22,29.49 180 top
C7  28.16,71.72 180 top
C8  47.7,31.39 270 top
C9  54.66,31.19 270 top
C10  67.46,68.81 90 top  (outside the outline)
C11  76.35,48.95 180 top  (outside the outline)
C12  53.49,69.98 90 top
C13  65.56,40.87 270 top  (outside the outline)
C14  41.35,30.48 270 top
C15  66.27,34.21 180 top  (outside the outline)
C16  43.97,36.53 180 top
C17  42.32,42.6 270 top
C18  39.95,39.27 90 top
C32  27.94,5.18 0 top
C33  35.36,4.62 0 top
C34  30.89,5.18 0 top
CN1  60.15,18.62 90 top
CN2  60.02,53.72 90 top
JP1  25.7,37.85 90 top
JP2  25.63,45.16 90 top
JP3  25.55,59.31 90 top
JP4  25.48,52.1 90 top
JP13  85.34,16.36 180 top  (outside the outline)
JP17  46.63,57.45 0 top
JP18  49.17,48.41 0 top
L1  38.66,42.52 270 top
L2  44.75,38.84 180 top
Q2  13.98,29.16 0 top
Q3  50.85,31.24 270 top
Q4  33.78,33.22 180 top
R1  30.47,46.55 180 bottom
R2  30.52,50.39 180 bottom
R3  36.14,53.54 90 top
R4  30.48,54.86 180 bottom
R5  30.48,61.47 180 bottom
R6  30.48,65.02 180 bottom
R7  17.94,25.5 180 top
R8  30.48,58.17 180 bottom
R9  38.25,53.52 90 top
R10  71.02,49.99 270 top  (outside the outline)
R11  71.93,54.05 270 top  (outside the outline)
R12  42.39,51.36 180 top
R13  42.77,49.58 180 top
R14  46.38,53.49 90 top
R15  81.92,35.53 90 top  (outside the outline)
R16  38.74,10.39 270 top
R17  75.64,29.21 90 top  (outside the outline)
R18  80.24,40.54 180 top  (outside the outline)
R19  75.64,35.1 90 top  (outside the outline)
R20  44.04,48.62 90 top
R21  17.37,34.85 90 top
R22  19.53,34.85 90 top
R38  33.3,14.71 180 top
R43  53.04,63.78 180 top
R87  24.43,9.35 0 top
R88  29.44,9.35 0 top
RX  57.45,5.54 0 top
RX1  30.44,46.55 90 top
RX2  30.62,61.99 90 top
RX3  30.57,54.53 90 top
RX4  20.6,39.98 270 top
S1  92.84,50.06 90 top  (outside the outline)
S2  96.22,35.66 90 top  (outside the outline)
SJ1  36.98,50.39 180 top
TX  57.48,9.8 0 top
TX1  30.6,50.39 90 top
TX2  30.62,65.52 90 top
TX3  30.62,57.9 90 top
TX4  20.62,37.69 270 top
U1  17.81,38.99 270 bottom
U2  17.68,46.25 270 bottom
U3  17.6,60.4 270 bottom
U4  17.68,53.39 270 bottom
U5  46.1,8.66 0 top
U6  42.27,39.62 270 top
U9  47.07,69.55 0 top
U14  33.86,9.45 0 top
VIN  57.91,62.47 180 top
X1  9.14,0 0 top

### Tracks (layer width: path | path; a pad name or v marks a point on that pad's centre or on a via)
3V  (3 unrouted)
+3V3  (20 unrouted)
  Bottom 0.254: 18.35,47.89 18.75,48.28 | 18.75,48.28 20.62,48.28 U2.1 | 18.3,48.73 18.75,48.28 | 18.3,55.06 18.64,55.4 20.65,55.4 U4.1 | 18.35,41.16 18.59,40.92 20.85,40.92 U1.1
+5V  (7 unrouted)
+9V  (via drill 0.5, 0.6)  (2 unrouted)
  Top 0.254: 24.89,70.1 24.89,71.45 24.84,71.5 24.84,71.55
  Top 0.406: X1.9 9.56,66.64 9.65,66.55 | X1.11 9.14,65.64 | X1.13 9.02,64.64 | X1.15 9.28,63.64 9.65,64.01
  Top 0.61: 24.34,72.37 C7.A 24.89,71.62 24.89,70.1 27.69,67.31 34.8,67.31 35.79,66.31
  Top 0.813: U9.3 51.08,64.75 51.23,64.59 | 51.23,64.59 R43.2 | 37.27,64.55 v37.49,64.77 | v51.23,66.09 51.23,64.59
  Bottom 0.406: X1.10 9.06,66.64 9.14,66.55 | X1.12 9.25,65.64 9.4,65.79 | X1.14 9.02,64.64 9.14,64.52 | X1.16 9.03,63.64 9.14,63.75
  Bottom 0.813: v37.49,64.77 37.49,66.14 38.18,66.83 50.49,66.83 v51.23,66.09
  other vias: 9.4,66.29 11.18,66.29 9.4,63.75 11.18,63.75 10.41,65.02
  pour Bottom: 8.89,66.8 11.68,66.8 11.68,63.25 8.89,63.25
  pour Top: 8.89,66.8 11.68,66.8 11.68,63.25 8.89,63.25
+12V  (via drill 0.6)
  Top 0.406: X1.1 9.65,70.64 | X1.3 9.14,69.64 | X1.5 9.65,68.64 | X1.7 8.96,67.64 9.14,67.82
  Bottom 0.406: X1.2 9.88,70.64 9.91,70.61 | X1.4 9.61,69.64 9.65,69.6 | X1.6 9.71,68.64 9.91,68.83 | X1.8 7.95,67.64 8.13,67.82 9.4,67.82 9.65,68.07
  other vias: 9.4,70.36 11.43,70.36 9.4,68.07 10.92,68.07 10.41,69.34
  pour Bottom: 9.14,67.82 11.18,67.82 11.68,68.33 11.68,71.12 9.14,71.12
  pour Top: 9.14,71.12 11.68,71.12 11.68,68.33 11.18,67.82 9.14,67.82
CLK  (1 unrouted)
DAT  (1 unrouted)
GND  (via drill 0.6)  (54 unrouted)
  Top 0.406: X1.123 8.25,5.64 8.36,5.74 9.88,5.74 10.03,5.89 | X1.121 10.19,6.64 10.34,6.78 | X1.119 9.69,7.64 9.7,7.64 | X1.117 9.91,8.64
  Bottom 0.406: X1.124 8.25,5.64 8.36,5.74 9.7,5.74 | X1.122 9.83,6.64 | X1.120 9.69,7.64 9.7,7.64 | X1.118 9.68,8.64
  other vias: 11.46,2.16 58.14,74.37
  pour Top (rank 4): 9.27,0.03 59.94,0.03 59.94,76.19 9.27,76.19
  pour Bottom (rank 4): 9.14,0 59.94,0 59.94,76.2 9.14,76.2
N$2  (1 unrouted)
N$3  (1 unrouted)
N$4  (1 unrouted)
N$5  (3 unrouted)
N$6  (2 unrouted)
N$7  (1 unrouted)
N$8  (1 unrouted)
N$9  (2 unrouted)
N$10  (2 unrouted)
N$11  (2 unrouted)
N$12  (1 unrouted)
N$13  (1 unrouted)
N$14  (1 unrouted)
N$15  (1 unrouted)
N$16  (3 unrouted)
N$17  (1 unrouted)
N$18  (1 unrouted)
N$19  (1 unrouted)
N$20  (1 unrouted)
N$21  (3 unrouted)
N$22  (1 unrouted)
N$24
  Top 0.254: R21.2 17.37,36.83 18.19,37.64 18.19,39.5 18.72,40.03 19.5,40.03 RX4.A
N$25  (1 unrouted)
N$26  (1 unrouted)
N$27  (3 unrouted)
N$28  (1 unrouted)
N$29  (1 unrouted)
N$30  (1 unrouted)
N$33
  Top 0.254: R43.1 57.66,63.78 VIN.A
N$44
  Top 0.254: R22.2 19.53,37.65 TX4.A
N$78  (1 unrouted)
N$79  (1 unrouted)
N$81  (1 unrouted)
N$82  (1 unrouted)
N$83  (1 unrouted)
N$84  (1 unrouted)
N$85  (6 unrouted)
N$93  (1 unrouted)
N$94  (1 unrouted)
RS485-1-A  (via drill 0.6)
  Top 0.254: X1.21 9.4,60.64 v9.63,60.63
  Bottom 0.254: v9.63,60.63 9.6,62.08 9.98,62.46 14.12,62.46 U3.8
RS485-1-B  (via drill 0.5)
  Top 0.254: X1.23 8.82,59.64 v9.53,58.93
  Bottom 0.254: v9.53,58.93 9.65,58.93 10.87,60.15 10.87,60.73 11.18,61.04 U3.7
RS485-1-Y  (via drill 0.6)
  Top 0.254: X1.19 10.37,61.64 10.77,61.24 10.77,58.78 v11.05,58.5
  Bottom 0.254: v11.05,58.5 U3.5
RS485-1-Z  (via drill 0.6)
  Top 0.254: X1.17 10.72,62.64 11.73,61.62 11.73,59.89 v11.84,59.79
  Bottom 0.254: v11.84,59.79 14.5,59.79 U3.6
RS485-2-A  (via drill 0.6)
  Top 0.254: X1.29 6.43,56.36 v12.75,56.36
  Bottom 0.254: v12.75,56.36 14.3,56.36 14.63,56.03 14.63,55.32 U4.8
RS485-2-B  (via drill 0.6)
  Top 0.254: X1.31 10.58,55.64 v10.95,55.27
  Bottom 0.254: v10.95,55.27 11.76,55.27 12.98,54.05 14.58,54.05 U4.7
RS485-2-Y  (via drill 0.5)
  Top 0.254: X1.27 7.85,57.64 v7.98,57.51
  Bottom 0.254: v7.98,57.51 8.18,57.51 9.22,56.46 9.22,52.78 10.52,51.49 U4.5
RS485-2-Z  (via drill 0.5)
  Top 0.254: v9.7,57.53 9.32,57.53 8.31,58.7 6.1,58.7 5.99,58.6 5.5,58.6 X1.25
  Bottom 0.254: U4.6 10.62,52.76 9.93,53.44 9.96,57.33 v9.7,57.53
RS485-3-A  (via drill 0.6)
  Top 0.254: X1.37 13.1,52.64 13.97,51.77 13.97,49.58 v14.05,49.51
  Bottom 0.254: v14.05,49.51 14.05,48.72 U2.8
RS485-3-B  (via drill 0.6)
  Top 0.254: X1.39 11.3,51.64 12.27,50.67 12.27,47.17 v12.57,46.86
  Bottom 0.254: v12.57,46.86 14.58,46.86 U2.7
RS485-3-Y  (via drill 0.5)
  Top 0.254: X1.35 10.04,53.64 10.49,53.19 14.94,53.19 15.32,52.81 15.32,45.59 v16.59,44.32
  Bottom 0.254: v16.59,44.32 14.63,44.32 U2.5
RS485-3-Z  (via drill 0.5)
  Top 0.254: X1.33 9.96,54.64 10.57,54.03 16.38,54.03 17.3,53.11 17.3,45.9 v17.02,45.62
  Bottom 0.254: v17.02,45.62 U2.6
RS485-4-A  (via drill 0.6)
  Top 0.254: X1.47 9.91,43.64 11.48,42.06 11.48,41.22 v11.71,41
  Bottom 0.254: v11.71,41 14.63,41 U1.8
RS485-4-B  (via drill 0.6)
  Top 0.254: X1.49 9.76,42.64 10.64,41.76 10.64,39.88 v10.34,39.57
  Bottom 0.254: v10.34,39.57 14.68,39.57 U1.7
RS485-4-Y  (via drill 0.6)
  Top 0.254: X1.45 10.56,44.64 12.95,42.24 12.95,37.26 v12.65,36.96
  Bottom 0.254: v12.65,36.96 14.61,36.96 U1.5
RS485-4-Z  (via drill 0.6)
  Top 0.254: X1.43 11.03,45.64 14,42.67 14,39.09 U1.6 16.76,38.35 v16.79,38.38
  Bottom 0.254: v16.79,38.38 14.02,38.38 14,38.41 14.68,38.41 U1.6
RXD1  (2 unrouted)
RXD2  (2 unrouted)
RXD3  (2 unrouted)
RXD4
  Top 0.254: RX4.C 25.17,39.98 JP1.2
  Bottom 0.254: U1.2 22.96,39.62 23.67,40.34 25.53,40.34 JP1.2
TXD1  (2 unrouted)
TXD2  (2 unrouted)
  Top 0.254: 29.26,58.22 TX3.C
TXD3  (2 unrouted)
TXD4
  Top 0.254: TX4.C 24.94,37.69 25.34,38.09 JP1.1
  Bottom 0.254: U1.3 25.07,38.35 JP1.1
VBUSD  (2 unrouted)
VUSB  (2 unrouted)

### Text on the board
tNames: 1